# EAGLE design 884 (EAGLE 9.4.2)
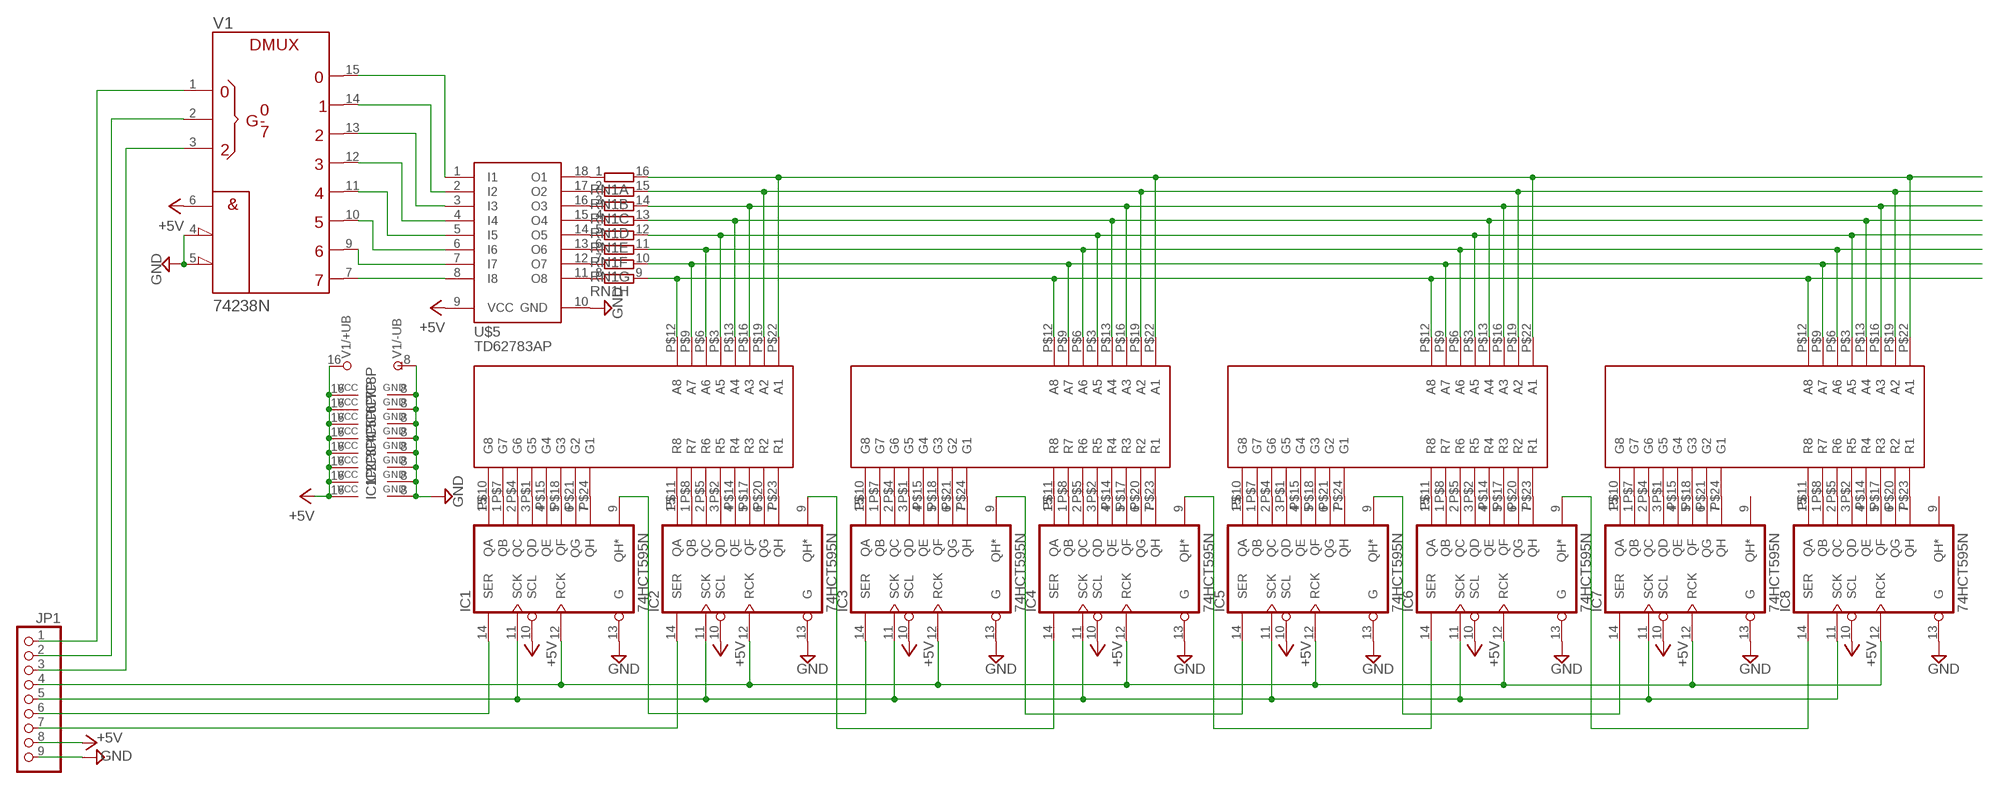
[diagram p0: schematic, sheet 1]

## Parts
IC1  74HCT595N  [DIL16]
IC2  74HCT595N  [DIL16]
IC3  74HCT595N  [DIL16]
IC4  74HCT595N  [DIL16]
IC5  74HCT595N  [DIL16]
IC6  74HCT595N  [DIL16]
IC7  74HCT595N  [DIL16]
IC8  74HCT595N  [DIL16]
JP1  PINHD-1X9  [1X09]
RN1  8R-N  [DIL16]
U$1  LED_ARRAY_8X8  [2.54*11-24]
U$2  LED_ARRAY_8X8  [2.54*11-24]
U$3  LED_ARRAY_8X8  [2.54*11-24]
U$4  LED_ARRAY_8X8  [2.54*11-24]
U$5  TD62783AP  [DIL18]
V1  74238N  [DIL16]

## Nets
+5V: IC1.10(SCL) IC1.16(VCC) IC2.10(SCL) IC2.16(VCC) IC3.10(SCL) IC3.16(VCC) IC4.10(SCL) IC4.16(VCC) IC5.10(SCL) IC5.16(VCC) IC6.10(SCL) IC6.16(VCC) IC7.10(SCL) IC7.16(VCC) IC8.10(SCL) IC8.16(VCC) JP1.8 U$5.9(VCC) V1.6(G1) V1.16(+UB)
GND: IC1.8(GND) IC1.13(G) IC2.8(GND) IC2.13(G) IC3.8(GND) IC3.13(G) IC4.8(GND) IC4.13(G) IC5.8(GND) IC5.13(G) IC6.8(GND) IC6.13(G) IC7.8(GND) IC7.13(G) IC8.8(GND) IC8.13(G) JP1.9 U$5.10(GND) V1.4(!G2A) V1.5(!G2B) V1.8(-UB)
N$1: IC1.1(QB) U$1.P$7(G7)
N$2: IC1.2(QC) U$1.P$4(G6)
N$3: IC1.3(QD) U$1.P$1(G5)
N$4: IC1.4(QE) U$1.P$15(G4)
N$5: IC1.5(QF) U$1.P$18(G3)
N$6: IC1.6(QG) U$1.P$21(G2)
N$7: IC1.7(QH) U$1.P$24(G1)
N$8: IC1.15(QA) U$1.P$10(G8)
N$9: IC2.1(QB) U$1.P$8(R7)
N$10: IC2.2(QC) U$1.P$5(R6)
N$11: IC2.3(QD) U$1.P$2(R5)
N$12: IC2.4(QE) U$1.P$14(R4)
N$13: IC2.5(QF) U$1.P$17(R3)
N$14: IC2.6(QG) U$1.P$20(R2)
N$15: IC2.7(QH) U$1.P$23(R1)
N$16: IC2.15(QA) U$1.P$11(R8)
N$17: IC2.14(SER) JP1.7
N$18: IC3.1(QB) U$2.P$7(G7)
N$19: IC3.2(QC) U$2.P$4(G6)
N$20: IC3.3(QD) U$2.P$1(G5)
N$21: IC3.4(QE) U$2.P$15(G4)
N$22: IC3.5(QF) U$2.P$18(G3)
N$23: IC3.6(QG) U$2.P$21(G2)
N$24: IC3.7(QH) U$2.P$24(G1)
N$25: IC3.15(QA) U$2.P$10(G8)
N$26: IC4.1(QB) U$2.P$8(R7)
N$27: IC4.2(QC) U$2.P$5(R6)
N$28: IC4.3(QD) U$2.P$2(R5)
N$29: IC4.4(QE) U$2.P$14(R4)
N$30: IC4.5(QF) U$2.P$17(R3)
N$31: IC4.6(QG) U$2.P$20(R2)
N$32: IC4.7(QH) U$2.P$23(R1)
N$33: IC4.15(QA) U$2.P$11(R8)
N$34: IC1.14(SER) JP1.6
N$35: IC5.1(QB) U$3.P$7(G7)
N$36: IC5.2(QC) U$3.P$4(G6)
N$37: IC5.3(QD) U$3.P$1(G5)
N$38: IC5.4(QE) U$3.P$15(G4)
N$39: IC5.5(QF) U$3.P$18(G3)
N$40: IC5.6(QG) U$3.P$21(G2)
N$41: IC5.7(QH) U$3.P$24(G1)
N$42: IC5.15(QA) U$3.P$10(G8)
N$43: IC6.1(QB) U$3.P$8(R7)
N$44: IC6.2(QC) U$3.P$5(R6)
N$45: IC6.3(QD) U$3.P$2(R5)
N$46: IC6.4(QE) U$3.P$14(R4)
N$47: IC6.5(QF) U$3.P$17(R3)
N$48: IC6.6(QG) U$3.P$20(R2)
N$49: IC6.7(QH) U$3.P$23(R1)
N$50: IC6.15(QA) U$3.P$11(R8)
N$51: IC2.9(QH*) IC4.14(SER)
N$52: IC7.1(QB) U$4.P$7(G7)
N$53: IC7.2(QC) U$4.P$4(G6)
N$54: IC7.3(QD) U$4.P$1(G5)
N$55: IC7.4(QE) U$4.P$15(G4)
N$56: IC7.5(QF) U$4.P$18(G3)
N$57: IC7.6(QG) U$4.P$21(G2)
N$58: IC7.7(QH) U$4.P$24(G1)
N$59: IC7.15(QA) U$4.P$10(G8)
N$60: IC8.1(QB) U$4.P$8(R7)
N$61: IC8.2(QC) U$4.P$5(R6)
N$62: IC8.3(QD) U$4.P$2(R5)
N$63: IC8.4(QE) U$4.P$14(R4)
N$64: IC8.5(QF) U$4.P$17(R3)
N$65: IC8.6(QG) U$4.P$20(R2)
N$66: IC8.7(QH) U$4.P$23(R1)
N$67: IC8.15(QA) U$4.P$11(R8)
N$68: IC3.9(QH*) IC5.14(SER)
N$69: IC4.9(QH*) IC6.14(SER)
N$70: IC5.9(QH*) IC7.14(SER)
N$71: IC6.9(QH*) IC8.14(SER)
N$72: U$5.8(I8) V1.7(Y7)
N$73: U$5.7(I7) V1.9(Y6)
N$74: U$5.6(I6) V1.10(Y5)
N$75: U$5.5(I5) V1.11(Y4)
N$76: U$5.4(I4) V1.12(Y3)
N$77: U$5.3(I3) V1.13(Y2)
N$78: U$5.2(I2) V1.14(Y1)
N$79: U$5.1(I1) V1.15(Y0)
N$81: IC1.12(RCK) IC2.12(RCK) IC3.12(RCK) IC4.12(RCK) IC5.12(RCK) IC6.12(RCK) IC7.12(RCK) IC8.12(RCK) JP1.4
N$82: IC1.11(SCK) IC2.11(SCK) IC3.11(SCK) IC4.11(SCK) IC5.11(SCK) IC6.11(SCK) IC7.11(SCK) IC8.11(SCK) JP1.5
N$85: RN1.1 U$5.18(O1)
N$86: RN1.2 U$5.17(O2)
N$87: RN1.3 U$5.16(O3)
N$88: RN1.4 U$5.15(O4)
N$89: RN1.5 U$5.14(O5)
N$90: RN1.6 U$5.13(O6)
N$91: RN1.7 U$5.12(O7)
N$92: RN1.8 U$5.11(O8)
N$93: RN1.16 U$1.P$22(A1) U$2.P$22(A1) U$3.P$22(A1) U$4.P$22(A1)
N$94: RN1.15 U$1.P$19(A2) U$2.P$19(A2) U$3.P$19(A2) U$4.P$19(A2)
N$95: RN1.14 U$1.P$16(A3) U$2.P$16(A3) U$3.P$16(A3) U$4.P$16(A3)
N$96: RN1.13 U$1.P$13(A4) U$2.P$13(A4) U$3.P$13(A4) U$4.P$13(A4)
N$97: RN1.12 U$1.P$3(A5) U$2.P$3(A5) U$3.P$3(A5) U$4.P$3(A5)
N$98: RN1.11 U$1.P$6(A6) U$2.P$6(A6) U$3.P$6(A6) U$4.P$6(A6)
N$99: RN1.10 U$1.P$9(A7) U$2.P$9(A7) U$3.P$9(A7) U$4.P$9(A7)
N$100: RN1.9 U$1.P$12(A8) U$2.P$12(A8) U$3.P$12(A8) U$4.P$12(A8)
N$101: JP1.3 V1.3(C)
N$102: JP1.2 V1.2(B)
N$103: JP1.1 V1.1(A)
N$105: IC1.9(QH*) IC3.14(SER)
Unconnected: IC7.9(QH*) IC8.9(QH*)

## Library data of the parts
IC1-IC8 = 74xx-eu:74*595: 8-bit SHIFT REGISTER, output latch
JP1 = pinhead:PINHD-1X9: PIN HEADER
RN1 = resistor-dil:8R-N: DIL RESISTOR; OC_FARNELL: unknown; OC_NEWARK: unknown
U$1-U$4 = My:LED_ARRAY_8X8: http://akizukidenshi.com/download/ds/liteon/ltp12188m.pdf
U$5 = Transistor_Robotech:TD62783
V1 = 74ttl-din:74*238: 1 of 8 noninverting DECODER/DEMULTIPLEXER

## Net classes
0 default: width 0.406 mm

## Board
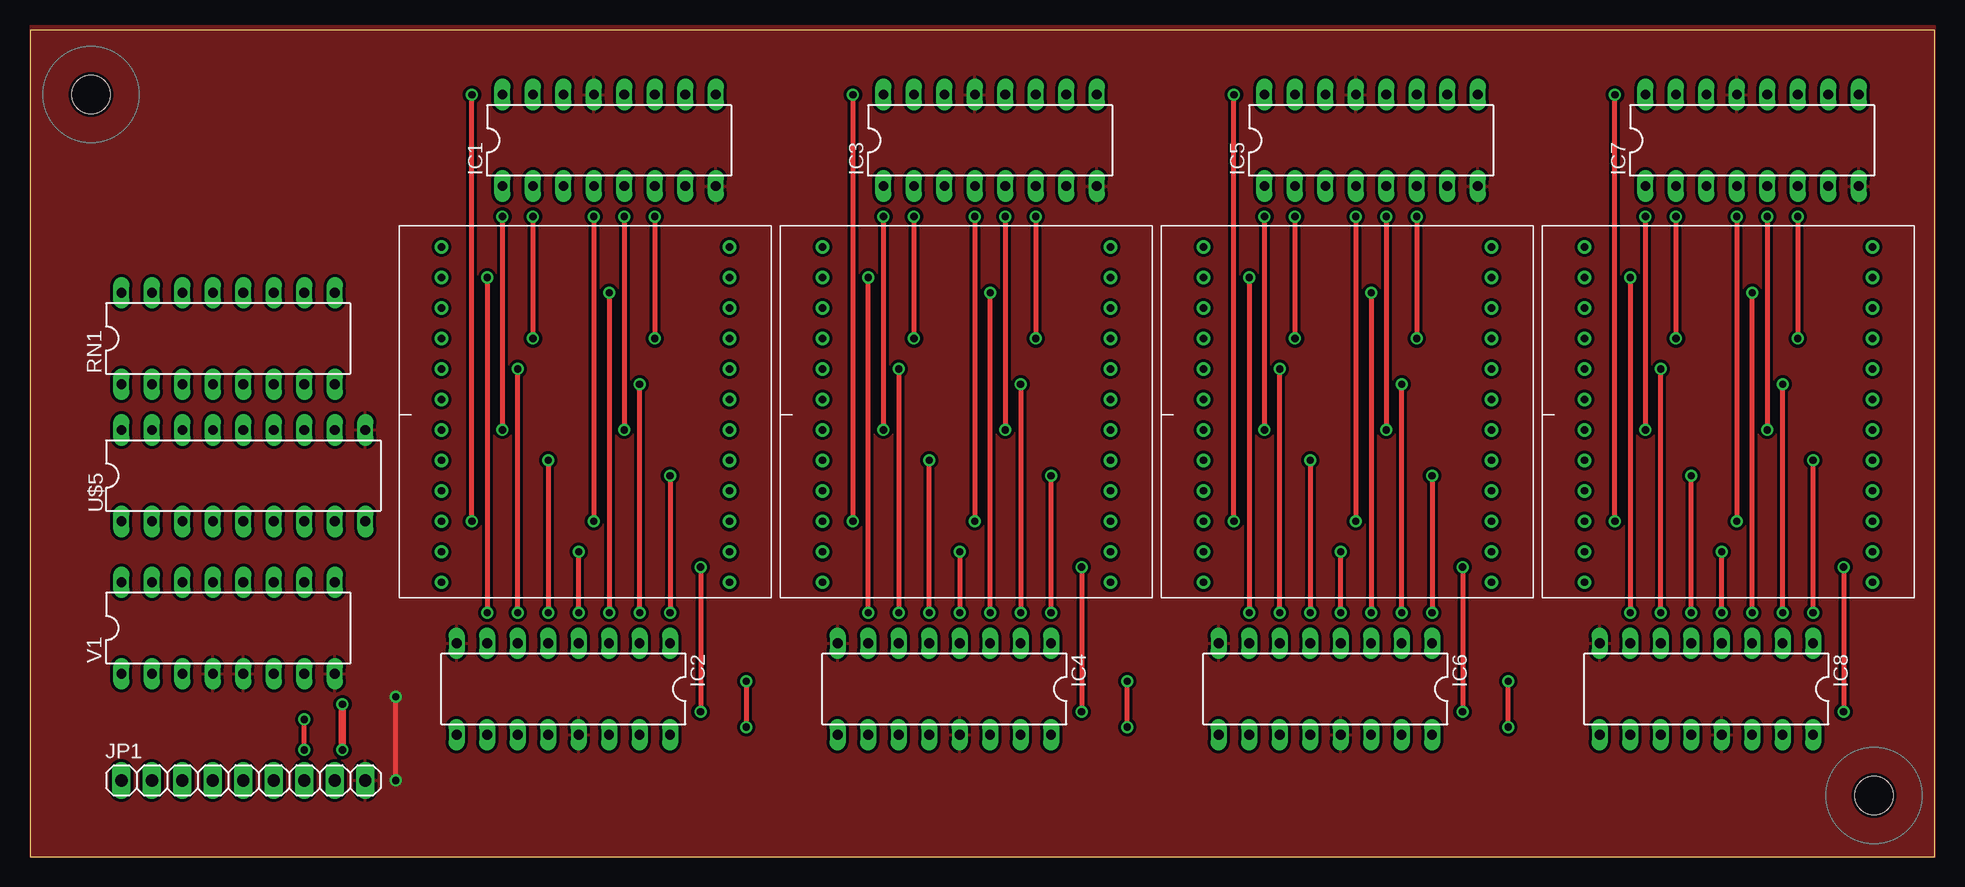
[diagram p1: board, top side]
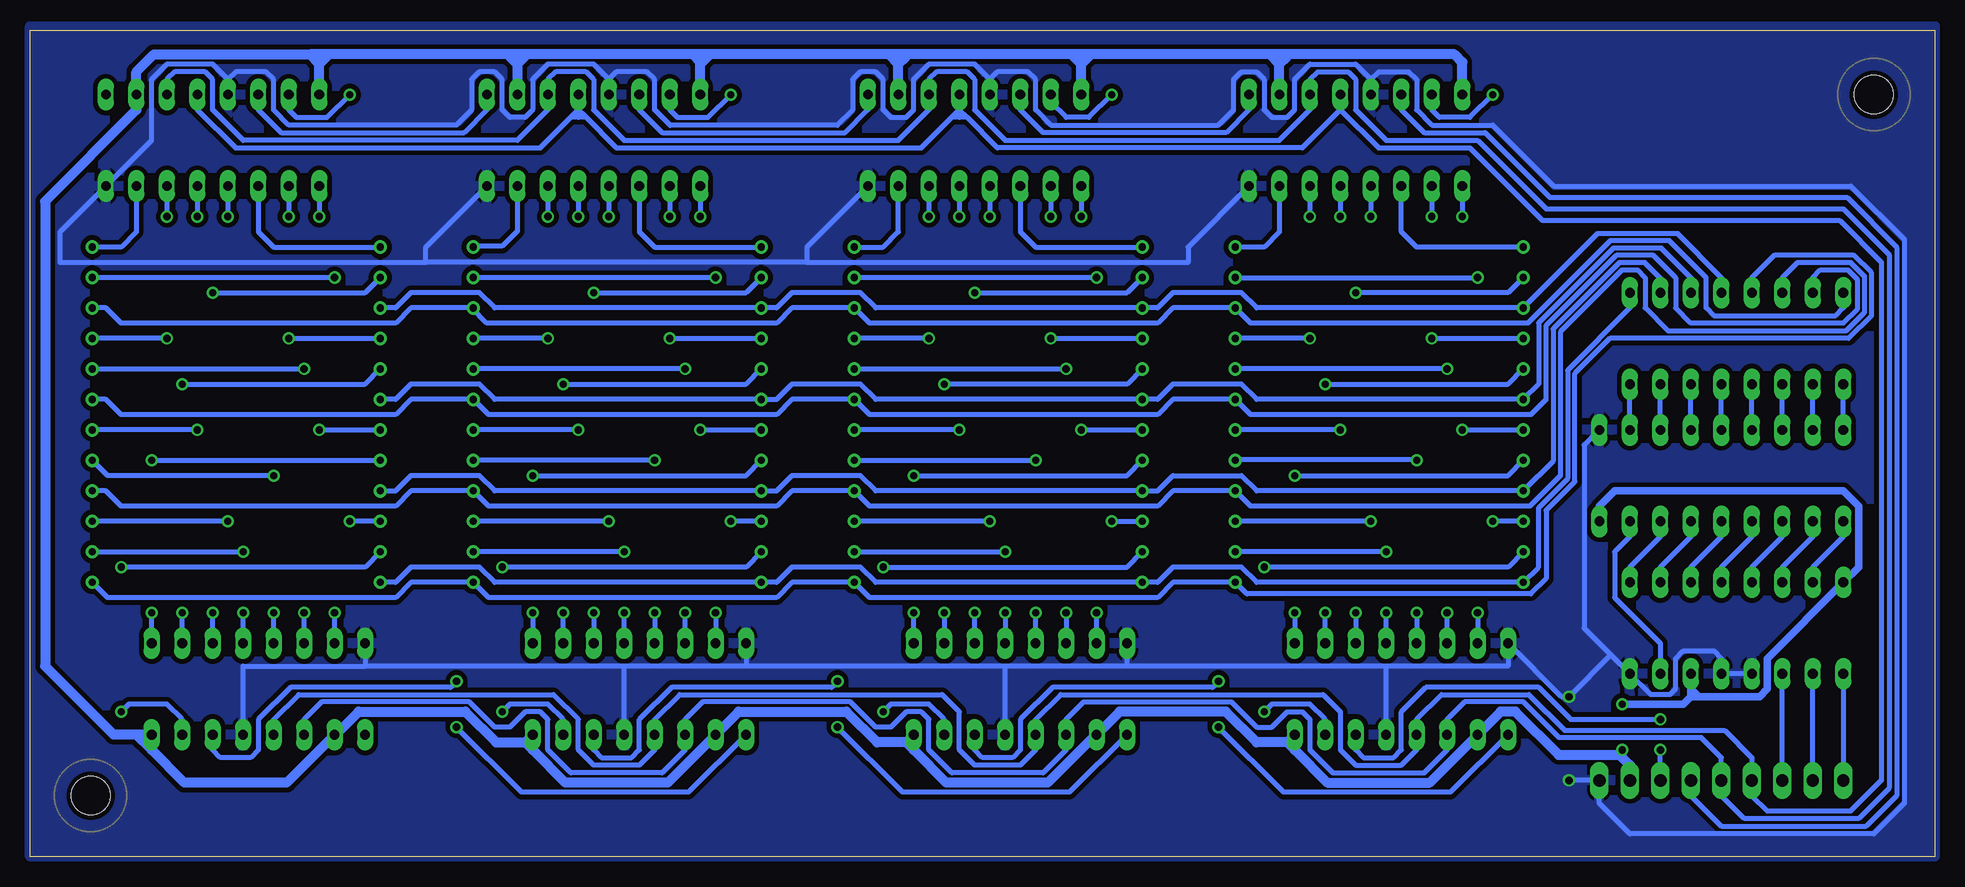
[diagram p2: board, bottom side, seen from below]

Size 158.73 x 68.89 mm. Coordinates in mm from the lower left corner, seen from the top.
Outline: 0,0 158.73,0 158.73,68.89 0,68.89 0,0
Copper layers (1*16): Top 0.0356mm / dielectric 1.5011mm / Bottom 0.0356mm
Design rules "formitaminimum": minimum track width 5mil, minimum drill 0.5994mm, track to track 0.2007mm, track to pad 0.2007mm, pad to pad 0.2007mm, via to via 0.2007mm, smd to smd 0mil, copper to edge 0mil, drill to drill 1mil, minimum pad ring 10mil, minimum via ring 8mil, stop-mask expansion 4mil, vias tented up to drill 1mm, thermal gap 10mil

### Footprints (pad centres in the part's own frame; a part is rotated, then mirrored left to right if it is on the bottom)
DIL16 = drill 0.813 long: 1 -8.89,-3.81; 2 -6.35,-3.81; 3 -3.81,-3.81; 4 -1.27,-3.81; 5 1.27,-3.81; 6 3.81,-3.81; 7 6.35,-3.81; 8 8.89,-3.81; 9 8.89,3.81; 10 6.35,3.81; 11 3.81,3.81; 12 1.27,3.81; 13 -1.27,3.81; 14 -3.81,3.81; 15 -6.35,3.81; 16 -8.89,3.81
1X09 = drill 1.016 long: 1 -10.16,0; 2 -7.62,0; 3 -5.08,0; 4 -2.54,0; 5 0,0; 6 2.54,0; 7 5.08,0; 8 7.62,0; 9 10.16,0
2.54*11-24 = drill 0.6: P$1 0,0; P$2 2.54,0; P$3 5.08,0; P$4 7.62,0; P$5 10.16,0; P$6 12.7,0; P$7 15.24,0; P$8 17.78,0; P$9 20.32,0; P$10 22.86,0; P$11 25.4,0; P$12 27.94,0; P$13 27.94,24; P$14 25.4,24; P$15 22.86,24; P$16 20.32,24; P$17 17.78,24; P$18 15.24,24; P$19 12.7,24; P$20 10.16,24; P$21 7.62,24; P$22 5.08,24; P$23 2.54,24; P$24 0,24
DIL18 = drill 0.813 long: 1 -10.16,-3.81; 2 -7.62,-3.81; 3 -5.08,-3.81; 4 -2.54,-3.81; 5 0,-3.81; 6 2.54,-3.81; 7 5.08,-3.81; 8 7.62,-3.81; 9 10.16,-3.81; 10 10.16,3.81; 11 7.62,3.81; 12 5.08,3.81; 13 2.54,3.81; 14 0,3.81; 15 -2.54,3.81; 16 -5.08,3.81; 17 -7.62,3.81; 18 -10.16,3.81
HOLE_3.2 = hole 3.2: 0,0

### Placement (x,y rotation side)
IC1  48.26,59.69 0 top
IC2  44.45,13.97 180 top
IC3  80.01,59.69 0 top
IC4  76.2,13.97 180 top
IC5  111.76,59.69 0 top
IC6  107.95,13.97 180 top
IC7  143.51,59.69 0 top
IC8  139.7,13.97 180 top
JP1  17.78,6.35 0 top
RN1  16.51,43.18 0 top
U$1  34.29,50.8 270 top
U$2  66.04,50.8 270 top
U$3  97.79,50.8 270 top
U$4  129.54,50.8 270 top
U$5  17.78,31.75 0 top
U$6  [HOLE_3.2]  5.08,63.5 0 top
U$7  [HOLE_3.2]  153.67,5.08 0 top
V1  16.51,19.05 0 top

### Tracks (layer width: path | path; a pad name or v marks a point on that pad's centre or on a via)
+5V  (via drill 0.6)
  Top 0.61: v26.04,12.7 v26.04,8.89
  Bottom 0.61: U$5.9 27.94,29.21 26.67,30.48 7.62,30.48 6.35,29.21 6.35,24.13 V1.16 13.97,16.51 13.97,13.97 14.61,13.34 19.68,13.34 | 19.68,13.34 20.32,13.97 V1.6 20.32,13.34 | 19.68,13.34 20.32,13.34 | 26.04,8.26 v26.04,8.89 26.44,8.48 26.67,8.48 | 20.32,13.34 20.95,12.7 v26.04,12.7
  Bottom 0.813: 53.98,66.85 40.01,66.85 39.37,66.22 IC1.16 | 53.98,66.85 54.61,66.85 | 54.61,66.85 55.42,66.85 | 55.42,66.85 70.48,66.85 | 70.48,66.85 71.12,66.85 | 71.12,66.85 71.75,66.85 | 71.75,66.85 85.72,66.85 | 85.72,66.85 86.36,66.85 | 86.36,66.85 87.17,66.85 | 87.17,66.85 102.23,66.85 | 102.23,66.85 102.87,66.85 | 102.87,66.85 103.5,66.85 | 103.5,66.85 117.3,66.85 | 117.3,66.85 118.11,66.85 | 118.11,66.85 118.75,66.85 | 118.75,66.85 133.99,66.85 | 133.99,66.85 134.62,66.85 | 134.62,66.85 135.43,66.85 | 118.11,66.85 118.11,66.04 | 118.11,66.04 IC5.10 | 117.3,66.85 118.11,66.04 | 118.11,66.04 118.75,66.67 118.75,66.85 | IC5.16 102.87,66.04 | 102.87,66.22 102.87,66.85 | 102.87,66.04 102.23,66.67 102.23,66.85 | 102.87,66.04 102.87,66.22 | 102.87,66.22 103.5,66.85 | IC3.10 86.36,66.04 | 86.36,66.04 86.36,66.85 | 86.36,66.04 85.72,66.67 85.72,66.85 | 86.36,66.04 87.17,66.85 | IC3.16 71.12,66.04 | 71.12,66.04 71.12,66.85 | 71.12,66.04 70.48,66.67 70.48,66.85 | 71.12,66.04 71.75,66.67 71.75,66.85 | IC1.10 54.61,66.04 | 54.61,66.04 54.61,66.85 | 54.61,66.04 53.98,66.67 53.98,66.85 | 54.61,66.04 55.42,66.85 | IC7.16 134.62,66.04 | 134.62,66.85 134.62,66.04 | 134.62,66.04 135.43,66.85 | 134.62,66.04 133.99,66.67 133.99,66.85 | 53.34,8.89 IC2.16 53.98,9.53 | 85.09,8.89 82.38,6.17 73.92,6.17 69.94,10.16 IC4.10 67.92,12.09 59.08,12.09 56.52,9.53 53.98,9.53 | 85.09,8.89 IC4.16 85.72,9.53 | 85.72,9.53 88.14,9.53 90.7,12.09 99.67,12.09 IC6.10 105.58,6.17 114.12,6.17 116.84,8.89 | 85.09,8.89 85.72,9.53 | 53.34,8.89 50.62,6.17 42.09,6.17 IC2.10 36.17,12.09 34.95,12.09 31.34,8.48 26.67,8.48 26.26,8.48 26.04,8.26 25.4,7.62 JP1.8 | 53.34,8.89 53.98,9.53
  Bottom 0.813: 116.84,8.89 IC6.16 117.47,9.53 | 117.47,9.53 119.89,9.53 122.45,12.09 131.34,12.09 133.26,10.16 IC8.10 137.34,6.17 145.88,6.17 148.59,8.89 | 116.84,8.89 117.47,9.53 | 148.59,8.89 IC8.16 149.86,10.16 | 149.86,10.16 151.76,10.16 157.48,15.88 157.48,54.61 149.86,62.23 IC7.10 149.86,65.41 148.41,66.85 135.43,66.85 | 148.59,8.89 149.86,10.16
GND  (via drill 0.6)
  Top 0.406: v30.48,6.35 v30.48,13.34
  Bottom 0.406: IC1.8 62.23,50.8 62.23,49.53 93.98,49.53 | 93.98,49.53 125.73,49.53 | 125.73,49.53 125.73,50.8 IC5.8 | 125.73,49.53 156.21,49.53 156.21,52.07 IC7.8 148.59,59.69 148.59,64.77 147.32,66.04 143.51,66.04 142.24,64.77 | IC3.8 93.98,50.8 93.98,49.53 | V1.4 V1.5 17.78,16.51 18.41,17.14 20.95,17.14 21.59,16.51 21.59,13.97 22.05,13.52 23.68,13.52 V1.8 26.99,16.83 | 26.99,16.83 29.21,19.05 29.21,34.29 U$5.10 | 78.74,64.77 80.01,66.04 83.82,66.04 85.09,64.77 85.09,62.23 85.72,61.59 87,61.59 87.63,62.23 87.63,64.77 88.27,65.41 89.53,65.41 90.17,64.77 90.17,62.2 91.44,60.93 105.38,60.93 106.68,62.23 106.68,64.77 107.31,65.41 109.86,65.41 110.49,64.77 | IC5.13 110.49,64.77 | 110.49,64.77 111.76,66.04 115.57,66.04 116.84,64.77 116.84,62.23 117.47,61.59 118.75,61.59 119.38,62.23 119.38,64.77 120.02,65.41 121.28,65.41 121.92,64.77 121.92,62.23 123.19,60.96 137.16,60.96 138.43,62.23 138.43,64.77 139.06,65.41 141.6,65.41 142.24,64.77 | IC7.13 142.24,64.77 | IC3.13 78.74,64.77 | 78.74,64.77 78.11,65.41 75.56,65.41 74.93,64.77 74.93,62.23 73.66,60.96 59.69,60.96 58.42,62.23 58.42,64.77 57.78,65.41 56.52,65.41 55.88,64.77 55.88,62.23 55.24,61.59 53.98,61.59 53.34,62.23 53.34,64.77 52.07,66.04 48.26,66.04 46.99,64.77 | IC1.13 46.99,64.77 | 46.99,64.77 46.35,65.41 43.81,65.41 43.18,64.77 43.18,62.23 41.91,60.96 36.83,60.96 31.75,55.88 6.99,55.88 2.54,51.44 2.54,4.45 5.08,1.91 25.4,1.91 27.94,4.45 JP1.9 v30.48,6.35 | IC6.8 99.06,15.88 | IC8.8 130.81,15.88 | 45.72,15.88 35.56,15.88 IC2.8 31.11,13.34 v30.48,13.34 26.99,16.83 | 45.72,15.88 67.31,15.88 | 67.31,15.88 IC4.8
  Bottom 0.406: 67.31,15.88 77.47,15.88 | 77.47,15.88 99.06,15.88 | 99.06,15.88 109.22,15.88 | 109.22,15.88 130.81,15.88 | IC2.13 45.72,15.88 | IC4.13 77.47,15.88 | IC6.13 109.22,15.88 | IC8.13 140.97,15.88 130.81,15.88
  pour Top (isolate 0.254): 0,69.22 0,0 158.75,0 158.75,69.22
  pour Bottom (isolate 0.406): 0,69.22 0,0 158.75,0 158.75,69.22
N$1  (via drill 0.6)
  Top 0.406: v39.37,53.34 v39.37,35.56
  Bottom 0.406: IC1.1 v39.37,53.34 | v39.37,35.56 U$1.P$7
N$2  (via drill 0.6)
  Top 0.406: v41.91,53.34 v41.91,43.18
  Bottom 0.406: IC1.2 v41.91,53.34 | v41.91,43.18 U$1.P$4
N$3
  Bottom 0.406: IC1.3 44.45,52.07 43.18,50.8 U$1.P$1
N$4  (via drill 0.6)
  Top 0.406: v46.99,53.34 v46.99,27.94
  Bottom 0.406: IC1.4 v46.99,53.34 | v46.99,27.94 U$1.P$15
N$5  (via drill 0.6)
  Top 0.406: v49.53,53.34 v49.53,35.56
  Bottom 0.406: IC1.5 v49.53,53.34 | v49.53,35.56 U$1.P$18
N$6  (via drill 0.6)
  Top 0.406: v52.07,53.34 v52.07,43.18
  Bottom 0.406: IC1.6 v52.07,53.34 | v52.07,43.18 U$1.P$21
N$7
  Bottom 0.406: IC1.7 54.61,52.07 55.88,50.8 U$1.P$24
N$8  (via drill 0.6)
  Top 0.406: v36.83,27.94 v36.83,63.5
  Bottom 0.406: U$1.P$10 v36.83,27.94 | v36.83,63.5 38.73,61.59 41.27,61.59 41.91,62.23 IC1.15
N$9  (via drill 0.6)
  Top 0.406: v53.34,31.75 v53.34,20.32
  Bottom 0.406: v53.34,31.75 35.56,31.75 U$1.P$8 | v53.34,20.32 IC2.1
N$10  (via drill 0.6)
  Top 0.406: v50.8,20.32 v50.8,39.37
  Bottom 0.406: IC2.2 v50.8,20.32 | v50.8,39.37 35.56,39.37 U$1.P$5
N$11  (via drill 0.6)
  Top 0.406: v48.26,46.99 v48.26,20.32
  Bottom 0.406: U$1.P$2 35.56,46.99 v48.26,46.99 | v48.26,20.32 IC2.3
N$12  (via drill 0.6)
  Top 0.406: v45.72,20.32 v45.72,25.4
  Bottom 0.406: v45.72,25.4 U$1.P$14 | IC2.4 v45.72,20.32
N$13  (via drill 0.6)
  Top 0.406: v43.18,33.02 v43.18,20.32
  Bottom 0.406: v43.18,20.32 IC2.5 | U$1.P$17 58.28,33.09 43.41,33.09 v43.18,33.02
N$14  (via drill 0.6)
  Top 0.406: v40.64,20.32 v40.64,40.64
  Bottom 0.406: IC2.6 v40.64,20.32 | v40.64,40.64 U$1.P$20
N$15  (via drill 0.6)
  Top 0.406: v38.1,48.26 v38.1,20.32
  Bottom 0.406: U$1.P$23 v38.1,48.26 | v38.1,20.32 IC2.7
N$16  (via drill 0.6)
  Top 0.406: v55.88,24.13 v55.88,12.06
  Bottom 0.406: U$1.P$11 35.56,24.13 v55.88,24.13 | IC2.15 50.8,11.43 52.07,12.7 55.24,12.7 v55.88,12.06
N$17  (via drill 0.6)
  Top 0.406: v22.86,8.89 v22.86,11.43
  Bottom 0.406: IC2.14 48.26,8.89 47.62,8.26 45.09,8.26 44.45,8.89 44.45,12.06 42.4,14.11 33.02,14.11 30.34,11.43 v22.86,11.43 | JP1.7 v22.86,8.89
N$18  (via drill 0.6)
  Top 0.406: v71.12,53.34 v71.12,35.56
  Bottom 0.406: IC3.1 v71.12,53.34 | v71.12,35.56 U$2.P$7
N$19  (via drill 0.6)
  Top 0.406: v73.66,53.34 v73.66,43.18
  Bottom 0.406: IC3.2 v73.66,53.34 | v73.66,43.18 U$2.P$4
N$20
  Bottom 0.406: U$2.P$1 74.93,50.8 76.2,52.07 IC3.3
N$21  (via drill 0.6)
  Top 0.406: v78.74,53.34 v78.74,27.94
  Bottom 0.406: IC3.4 v78.74,53.34 | v78.74,27.94 U$2.P$15
N$22  (via drill 0.6)
  Top 0.406: v81.28,53.34 v81.28,35.56
  Bottom 0.406: IC3.5 v81.28,53.34 | v81.28,35.56 U$2.P$18
N$23  (via drill 0.6)
  Top 0.406: v83.82,53.34 v83.82,43.18
  Bottom 0.406: IC3.6 v83.82,53.34 | v83.82,43.18 U$2.P$21
N$24
  Bottom 0.406: IC3.7 86.36,52.07 87.63,50.8 U$2.P$24
N$25  (via drill 0.6)
  Top 0.406: v68.58,63.5 v68.58,27.94
  Bottom 0.406: v68.58,27.94 U$2.P$10 | IC3.15 73.66,62.87 72.39,61.59 70.48,61.59 v68.58,63.5
N$26  (via drill 0.6)
  Top 0.406: v85.09,20.32 v85.09,31.75
  Bottom 0.406: v85.09,31.75 67.31,31.75 U$2.P$8 | IC4.1 v85.09,20.32
N$27  (via drill 0.6)
  Top 0.406: v82.55,39.37 v82.55,20.32
  Bottom 0.406: U$2.P$5 67.31,39.37 v82.55,39.37 | v82.55,20.32 IC4.2
N$28  (via drill 0.6)
  Top 0.406: v80.01,20.32 v80.01,46.99
  Bottom 0.406: v80.01,46.99 67.31,46.99 U$2.P$2 | IC4.3 v80.01,20.32
N$29  (via drill 0.6)
  Top 0.406: v77.47,25.4 v77.47,20.32
  Bottom 0.406: U$2.P$14 v77.47,25.4 | v77.47,20.32 IC4.4
N$30  (via drill 0.6)
  Top 0.406: v74.93,20.32 v74.93,33.02
  Bottom 0.406: U$2.P$17 v74.93,33.02 | IC4.5 v74.93,20.32
N$31  (via drill 0.6)
  Top 0.406: v72.39,40.64 v72.39,20.32
  Bottom 0.406: v72.39,20.32 IC4.6 | U$2.P$20 v72.39,40.64
N$32  (via drill 0.6)
  Top 0.406: v69.85,20.32 v69.85,48.26
  Bottom 0.406: IC4.7 v69.85,20.32 | v69.85,48.26 U$2.P$23
N$33  (via drill 0.6)
  Top 0.406: v87.63,24.13 v87.63,12.06
  Bottom 0.406: v87.63,24.13 67.31,24.13 U$2.P$11 | IC4.15 82.55,11.43 83.82,12.7 87,12.7 v87.63,12.06
N$34
  Bottom 0.406: IC1.14 44.45,62.23 42.55,60.33 37.47,60.33 32.07,54.93 7.3,54.93 3.17,50.8 3.17,5.08 5.71,2.54 17.78,2.54 20.32,5.08 JP1.6
N$35  (via drill 0.6)
  Top 0.406: v102.87,53.34 v102.87,35.56
  Bottom 0.406: IC5.1 v102.87,53.34 | v102.87,35.56 U$3.P$7
N$36  (via drill 0.6)
  Top 0.406: v105.41,53.34 v105.41,43.18
  Bottom 0.406: IC5.2 v105.41,53.34 | v105.41,43.18 U$3.P$4
N$37
  Bottom 0.406: U$3.P$1 106.68,50.8 107.95,52.07 IC5.3
N$38  (via drill 0.6)
  Top 0.406: v110.49,53.34 v110.49,27.94
  Bottom 0.406: IC5.4 v110.49,53.34 | v110.49,27.94 U$3.P$15
N$39  (via drill 0.6)
  Top 0.406: v113.03,53.34 v113.03,35.56
  Bottom 0.406: IC5.5 v113.03,53.34 | v113.03,35.56 U$3.P$18
N$40  (via drill 0.6)
  Top 0.406: v115.57,53.34 v115.57,43.18
  Bottom 0.406: IC5.6 v115.57,53.34 | v115.57,43.18 U$3.P$21
N$41
  Bottom 0.406: U$3.P$24 121.86,50.87 119.38,50.87 118.11,52.13 IC5.7
N$42  (via drill 0.6)
  Top 0.406: v100.33,27.94 v100.33,63.5
  Bottom 0.406: U$3.P$10 v100.33,27.94 | IC5.15 105.41,62.23 104.78,61.59 102.23,61.59 v100.33,63.5
N$43  (via drill 0.6)
  Top 0.406: v116.84,31.75 v116.84,20.32
  Bottom 0.406: v116.84,31.75 99.06,31.75 U$3.P$8 | v116.84,20.32 IC6.1
N$44  (via drill 0.6)
  Top 0.406: v114.3,20.32 v114.3,39.37
  Bottom 0.406: v114.3,39.37 99.06,39.37 U$3.P$5 | IC6.2 v114.3,20.32
N$45  (via drill 0.6)
  Top 0.406: v111.76,46.99 v111.76,20.32
  Bottom 0.406: v111.76,46.99 99.06,46.99 U$3.P$2 | v111.76,20.32 IC6.3
N$46  (via drill 0.6)
  Top 0.406: v109.22,20.32 v109.22,25.4
  Bottom 0.406: v109.22,25.4 U$3.P$14 | IC6.4 v109.22,20.32
N$47  (via drill 0.6)
  Top 0.406: v106.68,33.02 v106.68,20.32
  Bottom 0.406: v106.68,33.02 U$3.P$17 | v106.68,20.32 IC6.5
N$48  (via drill 0.6)
  Top 0.406: v104.14,20.32 v104.14,40.64
  Bottom 0.406: v104.14,40.64 U$3.P$20 | IC6.6 v104.14,20.32
N$49  (via drill 0.6)
  Top 0.406: v101.6,48.26 v101.6,20.32
  Bottom 0.406: v101.6,48.26 U$3.P$23 | v101.6,20.32 IC6.7
N$50  (via drill 0.6)
  Top 0.406: v119.38,24.13 v119.38,12.06
  Bottom 0.406: U$3.P$11 99.06,24.13 v119.38,24.13 | IC6.15 114.3,11.43 115.57,12.7 118.75,12.7 v119.38,12.06
N$51  (via drill 0.6)
  Top 0.406: v59.69,14.61 v59.69,10.79
  Bottom 0.406: IC4.14 80.01,8.89 79.38,8.26 76.83,8.26 76.2,8.89 76.2,11.43 73.52,14.11 60.18,14.11 v59.69,14.61 | IC2.9 40.36,5.36 54.26,5.36 v59.69,10.79
N$52  (via drill 0.6)
  Top 0.406: v134.62,53.34 v134.62,35.56
  Bottom 0.406: IC7.1 v134.62,53.34 | v134.62,35.56 U$4.P$7
N$53  (via drill 0.6)
  Top 0.406: v137.16,53.34 v137.16,43.18
  Bottom 0.406: IC7.2 v137.16,53.34 | v137.16,43.18 U$4.P$4
N$54
  Bottom 0.406: U$4.P$1 138.43,50.8 139.7,52.07 IC7.3
N$55  (via drill 0.6)
  Top 0.406: v142.24,53.34 v142.24,27.94
  Bottom 0.406: IC7.4 v142.24,53.34 | v142.24,27.94 U$4.P$15
N$56  (via drill 0.6)
  Top 0.406: v144.78,53.34 v144.78,35.56
  Bottom 0.406: IC7.5 v144.78,53.34 | v144.78,35.56 U$4.P$18
N$57  (via drill 0.6)
  Top 0.406: v147.32,53.34 v147.32,43.18
  Bottom 0.406: IC7.6 v147.32,53.34 | v147.32,43.18 U$4.P$21
N$58
  Bottom 0.406: U$4.P$24 151.13,50.8 149.86,52.07 IC7.7
N$59  (via drill 0.6)
  Top 0.406: v132.08,27.94 v132.08,63.5
  Bottom 0.406: U$4.P$10 v132.08,27.94 | v132.08,63.5 133.99,61.59 136.53,61.59 137.16,62.23 IC7.15
N$60  (via drill 0.6)
  Top 0.406: v148.59,20.32 v148.59,33.02
  Bottom 0.406: IC8.1 v148.59,20.32 | v148.59,33.02 U$4.P$8
N$61  (via drill 0.6)
  Top 0.406: v146.05,20.32 v146.05,39.37
  Bottom 0.406: IC8.2 v146.05,20.32 | v146.05,39.37 130.81,39.37 U$4.P$5
N$62  (via drill 0.6)
  Top 0.406: v143.51,20.32 v143.51,46.99
  Bottom 0.406: IC8.3 v143.51,20.32 | v143.51,46.99 130.81,46.99 U$4.P$2
N$63  (via drill 0.6)
  Top 0.406: v140.97,20.32 v140.97,25.4
  Bottom 0.406: IC8.4 v140.97,20.32 | U$4.P$14 v140.97,25.4
N$64  (via drill 0.6)
  Top 0.406: v138.43,20.32 v138.43,31.75
  Bottom 0.406: IC8.5 v138.43,20.32 | U$4.P$17 152.27,31.75 v138.43,31.75
N$65  (via drill 0.6)
  Top 0.406: v135.89,20.32 v135.89,40.64
  Bottom 0.406: IC8.6 v135.89,20.32 | U$4.P$20 v135.89,40.64
N$66  (via drill 0.6)
  Top 0.406: v133.35,48.26 v133.35,20.32
  Bottom 0.406: IC8.7 v133.35,20.32 | v133.35,48.26 U$4.P$23
N$67  (via drill 0.6)
  Top 0.406: v151.13,24.13 v151.13,12.06
  Bottom 0.406: v151.13,24.13 130.81,24.13 U$4.P$11 | IC8.15 146.05,11.43 147.32,12.7 150.5,12.7 v151.13,12.06
N$68
  Bottom 0.406: IC3.9 88.9,62.23 90.81,60.33 106.05,60.33 107.95,62.23 IC5.14
N$69  (via drill 0.6)
  Top 0.406: v91.44,10.79 v91.44,14.61
  Bottom 0.406: IC6.14 111.76,8.89 111.12,8.26 108.58,8.26 107.95,8.89 107.95,11.43 105.27,14.11 91.93,14.11 v91.44,14.61 | v91.44,10.79 86.01,5.36 72.11,5.36 IC4.9
N$70
  Bottom 0.406: IC7.14 139.7,62.23 137.79,60.33 122.56,60.33 120.65,62.23 IC5.9
N$71  (via drill 0.6)
  Top 0.406: v123.19,10.79 v123.19,14.61
  Bottom 0.406: v123.19,10.79 117.76,5.36 103.86,5.36 IC6.9 | v123.19,14.61 123.68,14.11 137.02,14.11 139.7,11.43 139.7,8.89 140.34,8.26 142.88,8.26 143.51,8.89 IC8.14
N$72
  Bottom 0.406: U$5.8 25.4,26.67 26.67,25.4 26.67,21.59 22.86,17.78 V1.7
N$73
  Bottom 0.406: U$5.7 22.86,26.67 25.4,24.13 V1.9
N$74
  Bottom 0.406: U$5.6 20.32,26.67 22.86,24.13 V1.10
N$75
  Bottom 0.406: U$5.5 17.78,26.67 20.32,24.13 V1.11
N$76
  Bottom 0.406: U$5.4 15.24,26.67 17.78,24.13 V1.12
N$77
  Bottom 0.406: U$5.3 12.7,26.67 15.24,24.13 V1.13
N$78
  Bottom 0.406: U$5.2 10.16,26.67 12.7,24.13 V1.14
N$79
  Bottom 0.406: U$5.1 7.62,26.67 10.16,24.13 V1.15
N$81
  Bottom 0.406: 81.28,62.23 80.64,61.59 | IC1.12 49.53,62.23 | IC3.12 81.28,62.23 | 81.28,62.23 81.92,61.59 | 81.92,61.59 84.45,59.05 109.86,59.05 112.39,61.59 | 112.39,61.59 113.03,62.23 | IC5.12 113.03,62.23 | 113.03,62.23 113.67,61.59 | 113.67,61.59 116.2,59.05 141.6,59.05 144.78,62.23 IC7.12 | 112.39,61.59 113.03,61.59 | 113.03,61.59 113.67,61.59 | 113.03,61.59 113.03,62.23 | 80.64,61.59 81.28,61.59 | 81.28,61.59 81.92,61.59 | 81.28,62.23 81.28,61.59 | 49.53,62.23 52.7,59.05 78.11,59.05 80.64,61.59 | 49.53,62.23 46.35,59.05 38.73,59.05 32.7,53.02 7.94,53.02 4.45,49.53 4.45,6.35 6.99,3.81 13.97,3.81 15.24,5.08 JP1.4 15.24,8.26 17.51,10.52 30.84,10.52 33.83,13.51 41.1,13.51 43.18,11.43 IC2.12 43.18,8.89 44.45,7.62 48.26,7.62 49.53,8.89 49.53,12.06 50.97,13.51 72.86,13.51 74.93,11.43 IC4.12 74.93,8.89 76.2,7.62 80.01,7.62 81.28,8.89 81.28,12.06 82.72,13.51 104.61,13.51 106.68,11.43 IC6.12 106.68,8.89 107.95,7.62 111.76,7.62 113.03,8.89 113.03,11.43 115.11,13.51 136.35,13.51 138.43,11.43 IC8.12
N$82
  Bottom 0.406: IC7.11 147.32,64.77 146.69,65.41 144.15,65.41 143.51,64.77 143.51,62.23 140.97,59.69 118.11,59.69 115.57,62.23 IC5.11 115.57,64.77 114.94,65.41 112.39,65.41 111.76,64.77 111.76,62.23 109.22,59.69 86.36,59.69 83.82,62.23 IC3.11 83.82,64.77 83.19,65.41 80.64,65.41 80.01,64.77 80.01,62.23 77.47,59.69 54.61,59.69 52.07,62.23 IC1.11 52.07,64.77 51.44,65.41 48.9,65.41 48.26,64.77 48.26,62.23 45.72,59.69 38.1,59.69 32.38,53.98 7.62,53.98 3.81,50.16 3.81,5.71 6.35,3.17 15.88,3.17 17.78,5.08 JP1.5 17.78,8.26 19.44,9.92 31.31,9.92 34.29,12.9 39.17,12.9 40.64,11.43 IC2.11 40.64,8.89 42.55,6.99 50.16,6.99 52.07,8.89 52.07,11.43 52.7,12.06 53.98,12.06 55.24,10.79 56.52,10.79 58.62,12.9 70.92,12.9 72.39,11.43 IC4.11 72.39,8.89 74.3,6.99 81.92,6.99 83.82,8.89 83.82,11.43 84.45,12.06 85.72,12.06 87,10.79 88.27,10.79 90.37,12.9 102.67,12.9 104.14,11.43 IC6.11 104.14,8.89 106.05,6.99 113.67,6.99 115.57,8.89 115.57,11.43 116.2,12.06 117.47,12.06 118.75,10.79 120.02,10.79 122.12,12.9 134.42,12.9 135.89,11.43 IC8.11
N$85
  Bottom 0.406: U$5.18 RN1.1
N$86
  Bottom 0.406: U$5.17 RN1.2
N$87
  Bottom 0.406: U$5.16 RN1.3
N$88
  Bottom 0.406: U$5.15 RN1.4
N$89
  Bottom 0.406: U$5.14 RN1.5
N$90
  Bottom 0.406: U$5.13 RN1.6
N$91
  Bottom 0.406: U$5.12 RN1.7
N$92
  Bottom 0.406: U$5.11 RN1.8
N$93
  Bottom 0.406: U$4.P$22 152.4,45.72 151.13,44.45 128.27,44.45 127,45.72 121.92,45.72 | RN1.16 7.62,45.72 8.26,45.09 18.41,45.09 19.05,45.72 19.05,48.26 22.11,51.32 27.04,51.32 33.91,44.45 57.02,44.45 U$1.P$22 63.5,45.72 64.77,44.45 88.77,44.45 U$2.P$22 95.25,45.72 96.52,44.45 120.65,44.45 121.92,45.72 | U$3.P$22 121.92,45.72
N$94
  Bottom 0.406: U$4.P$19 152.4,38.1 151.13,36.83 128.27,36.83 127,38.1 U$3.P$19 120.52,36.83 96.52,36.83 95.25,38.1 U$2.P$19 88.77,36.83 64.77,36.83 63.5,38.1 U$1.P$19 57.02,36.83 33.66,36.83 32.41,38.07 32.41,44.23 26.54,50.11 23.44,50.11 21.59,48.26 21.59,45.72 20.32,44.45 7.62,44.45 6.48,45.59 6.48,48.13 7.24,48.9 9.53,48.9 10.16,48.26 RN1.15
N$95
  Bottom 0.406: U$4.P$16 152.4,30.48 151.13,29.21 128.27,29.21 127,30.48 U$3.P$16 120.52,29.21 96.52,29.21 95.25,30.48 U$2.P$16 88.77,29.21 64.77,29.21 63.5,30.48 U$1.P$16 57.02,29.21 33.74,29.21 31.2,31.75 31.2,43.73 26.04,48.9 24.77,48.9 24.13,48.26 24.13,45.72 22.25,43.84 7.37,43.84 5.87,45.34 5.87,48.38 6.99,49.5 11.46,49.5 12.7,48.26 RN1.14
N$96
  Bottom 0.406: RN1.13 15.24,48.26 13.39,50.11 6.74,50.11 5.26,48.64 5.26,45.09 7.17,43.18 27.08,43.18 29.98,40.28 29.98,31.25 32.38,28.85 32.38,23.17 33.66,21.9 57.33,21.9 U$1.P$13 63.5,22.86 64.77,21.59 88.77,21.59 U$2.P$13 95.25,22.86 96.52,21.59 120.52,21.59 U$3.P$13 127,22.86 128.27,21.59 152.27,21.59 U$4.P$13
N$97
  Bottom 0.406: U$4.P$3 128.27,45.72 127,46.99 121.28,46.99 120.02,45.72 U$3.P$3 96.52,45.72 95.25,46.99 89.53,46.99 88.27,45.72 U$2.P$3 64.77,45.72 63.5,46.99 57.78,46.99 56.52,45.72 U$1.P$3 28.08,51.93 21.45,51.93 17.78,48.26 RN1.12
N$98
  Bottom 0.406: U$4.P$6 128.27,38.1 127,39.37 121.28,39.37 120.02,38.1 U$3.P$6 96.52,38.1 95.25,39.37 89.53,39.37 88.27,38.1 U$2.P$6 64.77,38.1 63.5,39.37 57.78,39.37 56.52,38.1 U$1.P$6 33.02,39.37 33.02,44.49 26.79,50.72 22.78,50.72 20.32,48.26 RN1.11
N$99
  Bottom 0.406: U$4.P$9 128.27,30.48 127,31.75 121.28,31.75 120.02,30.48 U$3.P$9 96.52,30.48 95.25,31.75 89.53,31.75 88.27,30.48 U$2.P$9 64.77,30.48 63.5,31.75 57.78,31.75 56.52,30.48 U$1.P$9 31.81,32.96 31.81,43.98 26.29,49.5 24.16,49.5 22.86,48.2 RN1.10
N$100
  Bottom 0.406: U$4.P$12 128.27,22.86 127,24.13 121.28,24.13 120.02,22.86 U$3.P$12 96.52,22.86 95.25,24.13 89.53,24.13 88.27,22.86 U$2.P$12 64.77,22.86 63.5,24.13 57.78,24.13 56.52,22.86 U$1.P$12 33.02,24.13 33.02,29.07 30.59,31.5 30.59,40.53 25.4,45.72 RN1.9
N$101
  Bottom 0.406: JP1.3 V1.3
N$102
  Bottom 0.406: JP1.2 V1.2
N$103
  Bottom 0.406: V1.1 JP1.1
N$105
  Bottom 0.406: IC1.9 57.15,62.23 59.05,60.33 74.3,60.33 76.2,62.23 IC3.14